# Altium project 飞控主板.PrjPcb
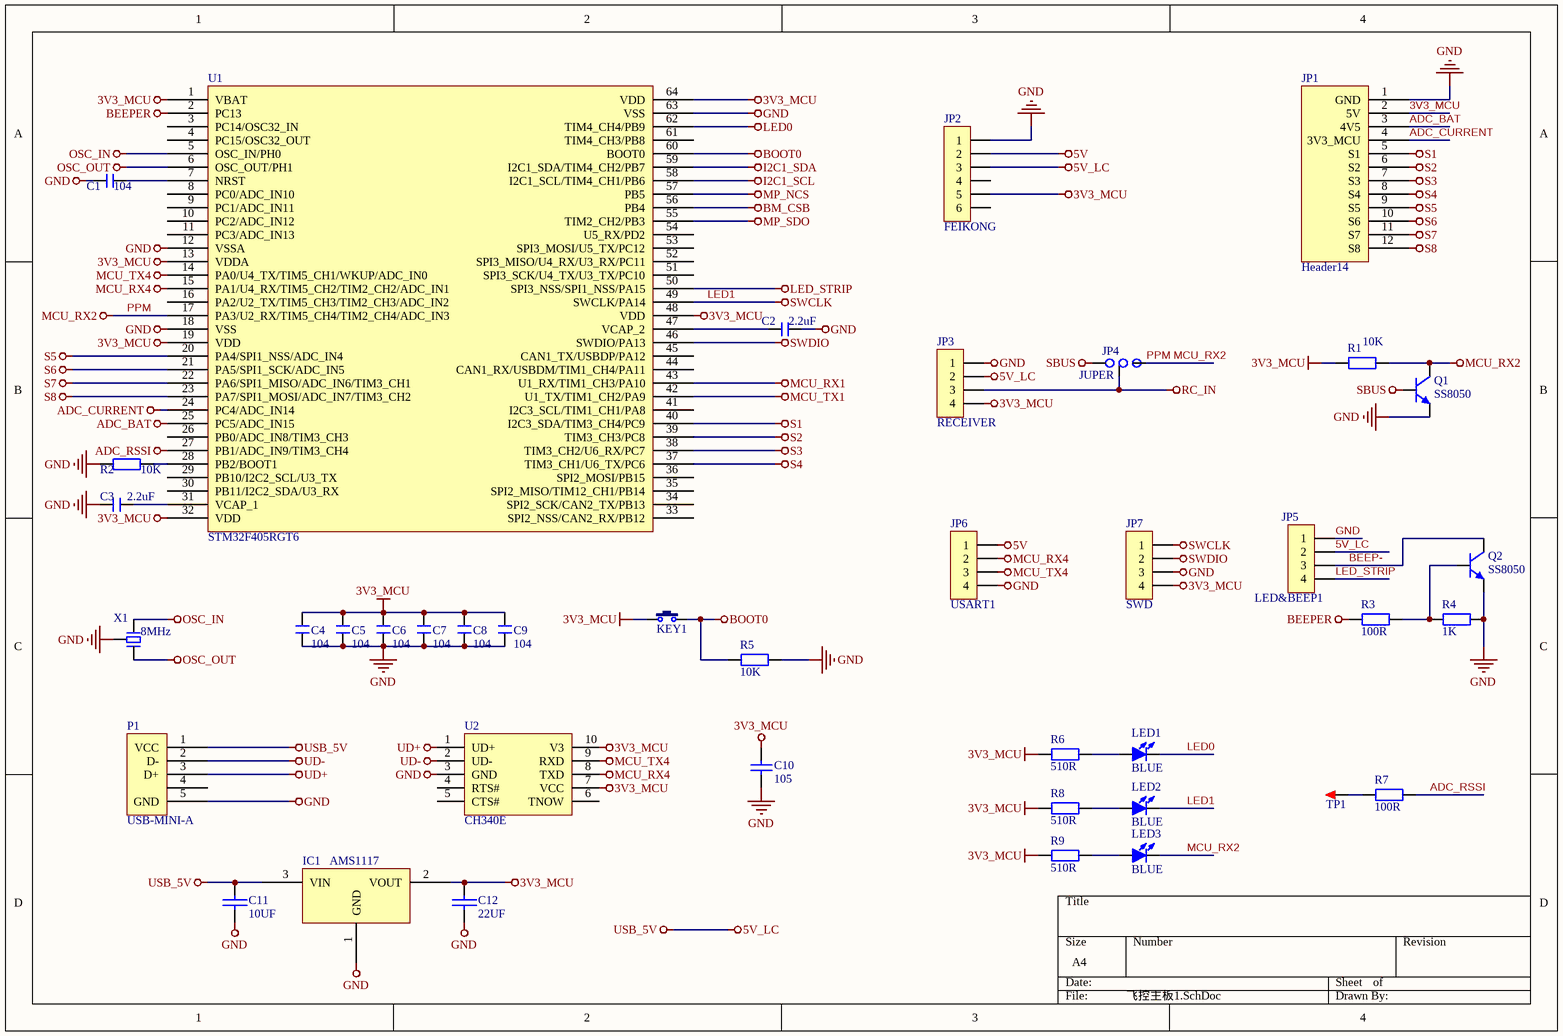
[diagram p0: 飞控主板1.SchDoc]
2 sheets, 49 parts. Net scope: global (net labels, ports and power ports of the same name join across sheets).
Board file: Copy of 飞控主板.PcbDoc
Sheets:
  飞控主板1.SchDoc
  飞控主板2.SchDoc

## Sheet 飞控主板1.SchDoc
size A4

### Parts
C1  104  [0603C]
C2  2.2uF  [0603C]
C3  2.2uF  [0603C]
C4  104  [0603C]
C5  104  [0603C]
C6  104  [0603C]
C7  104  [0603C]
C8  104  [0603C]
C9  104  [0603C]
C10  105  [0603C]
C11  10UF  [0603C]
C12  22UF  [0603C]
IC1  AMS1117  [AMS1117]
JP1  Header14  [Headr14]
JP2  FEIKONG  [SH1.0 S-W-6P]
JP3  RECEIVER  [SH1.0 S-W-4P]
JP4  JUPER  [JUMPER 3P]
JP5  LED&BEEP1  [SH1.0 S-W-4P]
JP6  USART1  [XH2.54-WI-4P]
JP7  SWD  [XH2.54-WI-4P]
KEY1  KEY  [SMD-3X6X2.5]  (value not drawn)
LED1  BLUE  [LED 0603R]
LED2  BLUE  [LED 0603R]
LED3  BLUE  [LED 0603R]
P1  USB-MINI-A  [USB-MINI-A]
Q1  SS8050  [SOT23-3L]
Q2  SS8050  [SOT23-3L]
R1  10K  [0805R]
R2  10K  [0805R]
R3  100R  [0805R]
R4  1K  [0805R]
R5  10K  [0805R]
R6  510R  [0805R]
R7  100R  [0805R]
R8  510R  [0805R]
R9  510R  [0805R]
TP1  TEST  [TEST PAD 1.8]  (value not drawn)
U1  STM32F405RGT6  [LQFP64 10X10_L]
U2  CH340E  [MSOP10]
X1  8MHz  [XTAL-3215-3P]

### Nets
3V3_MCU: C4.2 C5.2 C6.2 C7.2 C8.2 C9.2 C10.2 C12.2 IC1.2(VOUT) JP1.2(5V) JP2.5 JP3.4 JP7.4 KEY1.1 R1.1 R6.1 R8.1 R9.1 U1.1(VBAT) U1.13(VDDA) U1.19(VDD) U1.32(VDD) U1.48(VDD) U1.64(VDD) U2.7(VCC) U2.10(V3)
5V: JP2.2 JP6.1
5V_LC: C11.2 IC1.3(VIN) JP2.3 JP3.2 JP5.2 P1.1(VCC)  [also labelled USB_5V]
ADC_BAT: JP1.3(4V5) U1.25(PC5/ADC_IN15)
ADC_CURRENT: JP1.4(3V3_MCU) U1.24(PC4/ADC_IN14)
ADC_RSSI: R7.2 U1.27(PB1/ADC_IN9/TIM3_CH4)
BEEPER: R3.1 U1.2(PC13)
BM_CSB: U1.56(PB4)
BOOT0: KEY1.2 R5.1 U1.60(BOOT0)
GND: C1.1 C2.2 C3.1 C4.1 C5.1 C6.1 C7.1 C8.1 C9.1 C10.1 C11.1 C12.1 IC1.1(GND) JP1.1(GND) JP2.1 JP3.1 JP5.1 JP6.4 JP7.3 P1.0 P1.5(GND) Q1.2(E) Q2.2(E) R2.1 R4.2 R5.2 U1.12(VSSA) U1.18(VSS) U1.63(VSS) U2.3(GND) X1.2
I2C1_SCL: U1.58(I2C1_SCL/TIM4_CH1/PB6)
I2C1_SDA: U1.59(I2C1_SDA/TIM4_CH2/PB7)
LED0: LED1.2(K) U1.62(TIM4_CH4/PB9)
LED1: JP7.1 LED2.2(K) U1.49(SWCLK/PA14)  [also labelled SWCLK]
LED_STRIP: JP5.4 U1.50(SPI3_NSS/SPI1_NSS/PA15)
MCU_RX1: U1.43(U1_RX/TIM1_CH3/PA10)
MCU_RX2: JP4.3 LED3.2(K) Q1.3(C) R1.2 U1.17(PA3/U2_RX/TIM5_CH4/TIM2_CH4/ADC_IN3)  [also labelled PPM]
MCU_RX4: JP6.2 U1.15(PA1/U4_RX/TIM5_CH2/TIM2_CH2/ADC_IN1) U2.8(TXD)
MCU_TX1: U1.42(U1_TX/TIM1_CH2/PA9)
MCU_TX4: JP6.3 U1.14(PA0/U4_TX/TIM5_CH1/WKUP/ADC_IN0) U2.9(RXD)
MP_NCS: U1.57(PB5)
MP_SDO: U1.55(TIM2_CH2/PB3)
OSC_IN: U1.5(OSC_IN/PH0) X1.1
OSC_OUT: U1.6(OSC_OUT/PH1) X1.3
RC_IN: JP3.3 JP4.2
S1: JP1.5(S1) U1.40(I2C3_SDA/TIM3_CH4/PC9)
S2: JP1.6(S2) U1.39(TIM3_CH3/PC8)
S3: JP1.7(S3) U1.38(TIM3_CH2/U6_RX/PC7)
S4: JP1.8(S4) U1.37(TIM3_CH1/U6_TX/PC6)
S5: JP1.9(S5) U1.20(PA4/SPI1_NSS/ADC_IN4)
S6: JP1.10(S6) U1.21(PA5/SPI1_SCK/ADC_IN5)
S7: JP1.11(S7) U1.22(PA6/SPI1_MISO/ADC_IN6/TIM3_CH1)
S8: JP1.12(S8) U1.23(PA7/SPI1_MOSI/ADC_IN7/TIM3_CH2)
SBUS: JP4.1 Q1.1(B)
SWDIO: JP7.2 U1.46(SWDIO/PA13)
UD+: P1.3(D+) U2.1(UD+)
UD-: P1.2(D-) U2.2(UD-)
BEEP-: JP5.3 Q2.3(C)
NetC1_2: C1.2 U1.7(NRST)
NetC2_1: C2.1 U1.47(VCAP_2)
NetC3_2: C3.2 U1.31(VCAP_1)
NetLED1_1: LED1.1(A) R6.2
NetLED2_1: LED2.1(A) R8.2
NetLED3_1: LED3.1(A) R9.2
NetQ2_1: Q2.1(B) R3.2 R4.1
NetR2_2: R2.2 U1.28(PB2/BOOT1)
NetR7_1: R7.1 TP1.1

Not connected (* = marked no-connect by the designer): JP2 4 6; P1 4; U1 3(PC14/OSC32_IN) 4(PC15/OSC32_OUT) 8(PC0/ADC_IN10) 9(PC1/ADC_IN11) 10(PC2/ADC_IN12) 11(PC3/ADC_IN13) 16(PA2/U2_TX/TIM5_CH3/TIM2_CH3/ADC_IN2) 26(PB0/ADC_IN8/TIM3_CH3) 29(PB10/I2C2_SCL/U3_TX) 30(PB11/I2C2_SDA/U3_RX) 33(SPI2_NSS/CAN2_RX/PB12) 34(SPI2_SCK/CAN2_TX/PB13) 35(SPI2_MISO/TIM12_CH1/PB14) 36(SPI2_MOSI/PB15) 41(I2C3_SCL/TIM1_CH1/PA8) 44(CAN1_RX/USBDM/TIM1_CH4/PA11) 45(CAN1_TX/USBDP/PA12) 51(SPI3_SCK/U4_TX/U3_TX/PC10) 52(SPI3_MISO/U4_RX/U3_RX/PC11) 53(SPI3_MOSI/U5_TX/PC12) 54(U5_RX/PD2) 61(TIM4_CH3/PB8); U2 4(RTS#) 5(CTS#) 6(TNOW)

### Library data of the parts
C1-C9 = C: 无极性贴片电容; 版权归属: 源创客; BOM名称: 无极性贴片电容; 学习资源: www.ooocke.com
C10 = cap: U: 50V; 参数: Cap,0805,X7R,104K,50V,125C,±10%; C: 105
C11 C12 = CAP: 无极性电容
IC1 = AMS1117: 3V3降压芯片
JP1 = Header14: 14PIN接插件
JP2 = Header 6: 6P接插件; 版权归属: 源创客; BOM名称: 6P接插件; 学习资源: www.ooocke.com
JP3 JP5-JP7 = Header 4: 4P接插件; 版权归属: 源创客; BOM名称: 4P接插件; 学习资源: www.ooocke.com
JP4 = JUMPER 3P: 三点焊盘跳线
KEY1 = KEY: 按键; BOM名称: 3x6轻触开关; 版权归属: 源创客; 学习资源: www.ooocke.com
LED1-LED3 = LED-SMD: 贴片LED; 版权归属: 源创客; BOM名称: 贴片LED; 学习资源: www.ooocke.com
P1 = MICRO USB 5PIN: _Comma: ,; _Name: Port; _Specification: Port,USB-MINI-A,5PIN; _Value: 5PIN; _Model: USB-MINI-A
Q1 Q2 = 8050-SMD: 高频放大-NPN型; 版权归属: 源创客; 属性: 40V 1.5A 1W 100MHZ; BOM名称: 高频放大-NPN型; 学习资源: www.ooocke.com
R1-R9 = R: 贴片电阻; 版权归属: 源创客; BOM名称: 贴片电阻; 学习资源: www.ooocke.com
TP1 = TEST: 测试点; 版权归属: 源创客; BOM名称: 测试点; 学习资源: www.ooocke.com
U1 = STM32F405RGT6: Flaah:256/RAM:48/IO:51
U2 = CH340E: _Comma: ,; _Name: USB-UART; _Specification: USB-UART,CH340E,MSOP10; _Footprint: MSOP10; _Model: CH340E
X1 = XTAL-3P: 3脚无源晶振; BOM名称: 2脚晶振; 版权归属: 源创客; 学习资源: www.ooocke.com

## Sheet 飞控主板2.SchDoc
size A4
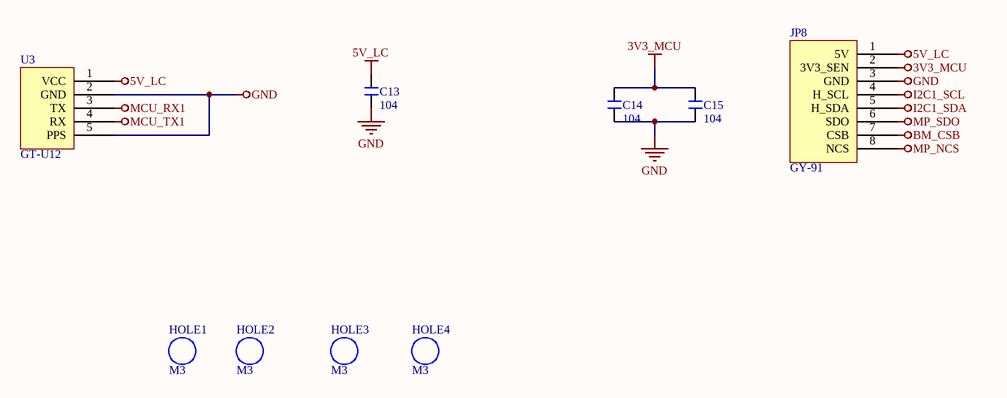
[diagram p1: 飞控主板2.SchDoc]

### Parts
C13  104  [0603C]
C14  104  [0603C]
C15  104  [0603C]
HOLE1  M3  [M3 5.4MM]
HOLE2  M3  [M3 5.4MM]
HOLE3  M3  [M3 5.4MM]
HOLE4  M3  [M3 5.4MM]
JP8  GY-91  [GY-91]
U3  GT-U12  [GT-U12]

### Nets
3V3_MCU: C14.2 C15.2 JP8.2(3V3_SEN)
5V_LC: C13.2 JP8.1(5V) U3.1(VCC)
BM_CSB: JP8.7(CSB)
GND: C13.1 C14.1 C15.1 JP8.3(GND) U3.2(GND) U3.5(PPS)
I2C1_SCL: JP8.4(H_SCL)
I2C1_SDA: JP8.5(H_SDA)
MCU_RX1: U3.3(TX)
MCU_TX1: U3.4(RX)
MP_NCS: JP8.8(NCS)
MP_SDO: JP8.6(SDO)

### Library data of the parts
C13-C15 = C: 无极性贴片电容; 版权归属: 源创客; BOM名称: 无极性贴片电容; 学习资源: www.ooocke.com
HOLE1-HOLE4 = M3: 铜柱孔; 版权归属: 源创客; BOM名称: 铜柱孔; 学习资源: www.ooocke.com
JP8 = GY-91: 优信电子GY-91接口，MPU9250+BMP280
U3 = GT-U12: GPS模块

## Nets that join several sheets
3V3_MCU: 飞控主板1 (26 pins), 飞控主板2 (C14.2 C15.2 JP8.2)
5V_LC: 飞控主板1 (6 pins), 飞控主板2 (C13.2 JP8.1 U3.1)
BM_CSB: 飞控主板1 (U1.56), 飞控主板2 (JP8.7)
GND: 飞控主板1 (31 pins), 飞控主板2 (6 pins)
I2C1_SCL: 飞控主板1 (U1.58), 飞控主板2 (JP8.4)
I2C1_SDA: 飞控主板1 (U1.59), 飞控主板2 (JP8.5)
MCU_RX1: 飞控主板1 (U1.43), 飞控主板2 (U3.3)
MCU_TX1: 飞控主板1 (U1.42), 飞控主板2 (U3.4)
MP_NCS: 飞控主板1 (U1.57), 飞控主板2 (JP8.8)
MP_SDO: 飞控主板1 (U1.55), 飞控主板2 (JP8.6)